# EasyEDA Pro project Omnimo_nRF52840.eprj, board Omnimo_nRF52840_v1_1
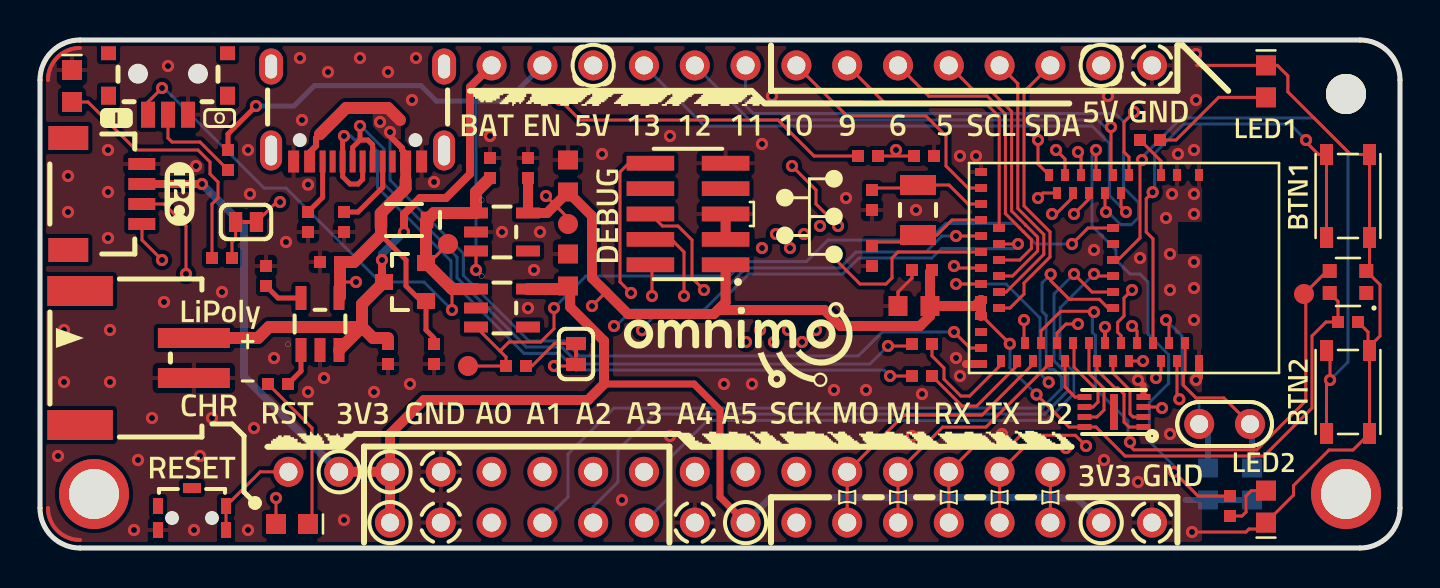
[diagram p2: board, top side]
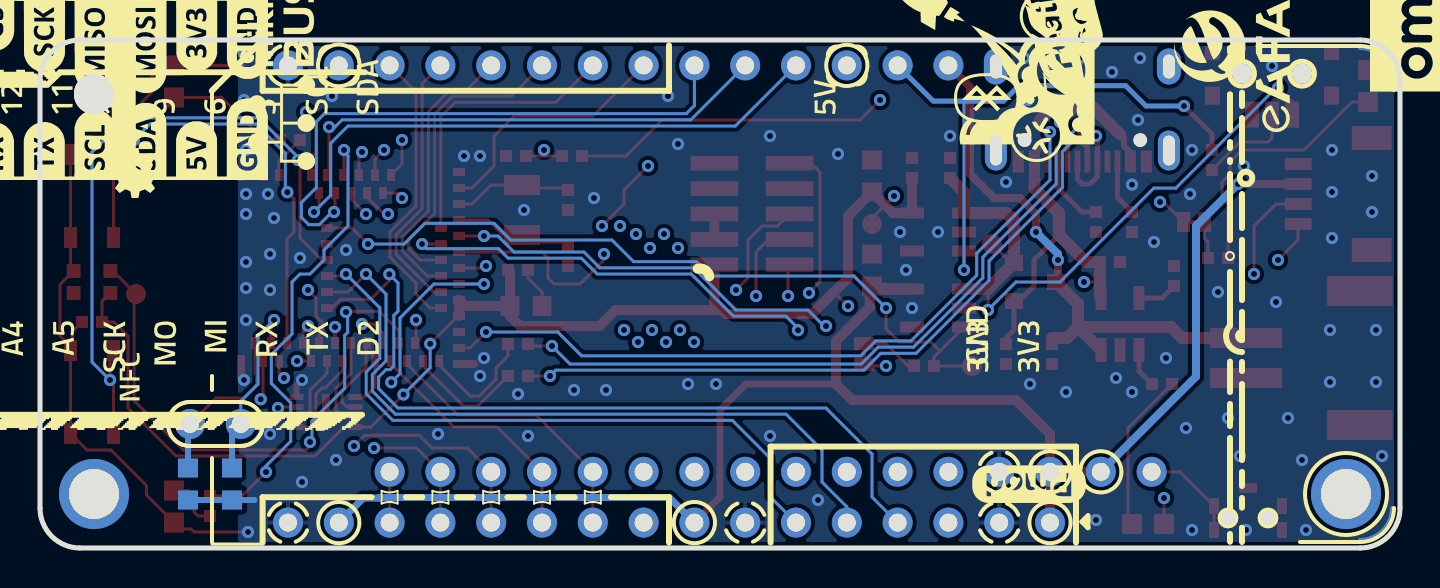
[diagram p3: board, bottom side, seen from below]

Outline 68 x 25.4 mm; copper layers: Top Layer, Mid-Top, Mid-Bottom, Bottom Layer. Coordinates in mm from the lower left corner of the outline.
Outline path: 0,23.4 arc(0.59,24.81) 2,25.4 66,25.4 arc(67.41,24.81) 68,23.4 68,2 arc(67.41,0.59) 66,0 2,0 arc(0.59,0.59) 0,2 0,23.4
Stack: Top Layer 0.035mm / Dielectric 1 0.27mm FR-4 er 4.5 / Mid-Top 0.017mm / Dielectric2 0.93mm FR-4 er 4.5 / Mid-Bottom 0.017mm / Dielectric3 0.27mm FR-4 er 4.5 / Bottom Layer 0.035mm

## Design rules (mm)
template: User Custom Config
spacing Clearance (default): track to track 0.15, other pairs 0.127 to 0.254
track width Width_1: min 0.15, default 0.31, max 1.001
track width Width (default): min 0.15, default 0.15, max 1
differential pair DiffPairsRouting (default): width min 0.381, default 0.381, max 0.381; gap min 0.254, default 0.254
via RoutingVias (default): diameter min 0.45, default 0.61, max 1.27; hole min 0.201, default 0.305, max 0.635

## Placement (name value [footprint] x y rotation side)
C1  10uF  [0603_Nom]  26.4 18.6 90 top
C2  1uF  [0402_NOM]  24.4 19 90 top
C3  1uF  [0402_NOM]  22.5 19 90 top
C4  100nF  [0402_NOM]  65.4 11.3 0 top
C5  4.7uF  [0402_NOM]  14.5 14.3 180 top
C6  4.7uF  [0402_NOM]  17.4 9.7 270 top
C7  12pF  [0402_NOM]  41.6 17.4 90 top
C8  12pF  [0402_NOM]  41.6 14.6 90 top
C9  10uF  [0603_Nom]  43.7 12.1 180 top
C11  100nF  [0402_NOM]  44.1 13.9 180 top
C21  DNP  [0603_Nom]  58.4 3.2 90 bottom
C22  DNP  [0603_Nom]  60.6 3.2 270 bottom
C24  10uF  [0603_Nom]  26.4 13.9 90 top
D1  RED  [LED-0603_2]  1.6 23.1 90 top
D2  ORANGE  [LED-0603_2]  12.6 1.2 0 top
D3  BLUE  [LED-0603_2]  61.3 2.07 270 top
D4  RED  [LED-0603_2]  61.3 23.33 90 top
D5  WS2812C-2020-V1  [WS2812-2020]  65.4 13.3 0 top
D6  BAT60B  [SOD-323]  18.2 16.4 180 top
J1  S2B-PH-SM4-TB(LF)(SN)  [conn-smd_p2.00_s2b-ph-sm4-tb-lf-sn]  4.87 9.5 270 top
J2L  omnimo_Header_left  [Omnimo_HDR_Left_nRF52_2 - without silk screen]  55.6 1.27 90 top
J2R  omnimo_Header_right  [Omnimo_HDR_Right_nRF52_2 - without silk screen]  55.6 24.13 90 top
J3  SM04B-SRSS-TB(LF)(SN)  [1x04_1mm_ra]  2.93 17.7 270 top
J4  FTSH-105-01-L-DV-K-TR  [SAMTEC_FTSH-105-XX-X-DV]  32.4 16.7 90 top
J5  TYPE-C 16PIN 2MD(073)  [usb-c-smd_type-c-6pin-2md-073]  15.88 21.7 180 top
J6  CONN_021X02  [1X02_NFC]  60.5 6.2 180 top
JP1  JUMPER-SMT_2_NC_TRACE_SILK  [SMT-JUMPER_2_NC_TRACE_SILK_2]  10.3 16.3 180 top
JP2  JUMPER-SMT_2_NC_TRACE_SILK  [SMT-JUMPER_2_NC_TRACE_SILK_2]  26.8 9.7 270 top
NOREF  -  [Pad_ie133]  65.3 2.7 0 top
NOREF#2  -  [Pad_ie134]  2.7 2.7 0 top
NOREF#3  -  [Pad_ie132]  65.3 22.7 0 top
Q3  DMG2305UXQ-7  [sot23-3]  18.3 13.3 0 top
R2  100kΩ  [0402_NOM]  19.7 9.7 90 top
R3  2.2kΩ  [0402_NOM]  55.5 20.4 0 top
R4  100kΩ  [0402_NOM]  9.4 19.4 90 top
R5  2kΩ  [0402_NOM]  11.3 13.6 270 top
R6  5.1kΩ  [0402_NOM]  11.9 8.2 180 top
R11  10kΩ  [0402_NOM]  9.1 14.5 180 top
R13  2.2kΩ  [0402_NOM]  59.5 2.1 270 top
R14  100kΩ  [0402_NOM]  41.4 19.6 180 top
R15  100kΩ  [0402_NOM]  44.2 19.6 180 top
R21  27Ω  [0402_NOM]  44.1 10.2 0 top
R22  27Ω  [0402_NOM]  44.1 8.6 0 top
R24  100kΩ  [0402_NOM]  23.8 9.1 0 top
R25  5.1kΩ  [0402_NOM]  13.4 16.3 90 top
R26  5.1kΩ  [0402_NOM]  15.2 16.3 90 top
S1  TA-3514-A1-B  [sw-smd_ta-3514-a1-b]  6.4 23.24 180 top
S2  R-667270  [sw-smd_mitsumi_r-667270]  7.6 1.95 0 top
S3  PTS815SJG250SMTRLFS  [SW_PTS810_SJM_250_SMTR_LFS]  65.4 17.6 90 top
S4  PTS815SJG250SMTRLFS  [SW_PTS810_SJM_250_SMTR_LFS]  65.4 7.8 90 top
TP1  TEST-POINT3X5  [TEST_POINT_1mm]  20.4 15.2 90 top
TP2  TEST-POINT3X5  [TEST_POINT_1mm]  26.4 16.2 90 top
TP3  TEST-POINT3X5  [TEST_POINT_1mm]  21.4 9.1 90 top
TP4  TEST-POINT3X5  [TEST_POINT_1mm]  63.2 12.7 90 top
U1  MDBT50Q  [MDBT50Q-1MV2]  54.2 14 270 top
U2  MCP73831T-2ACI/OT  [SOT23-5]  14 11.2 0 top
U3  AP2112K-3.3TRG1  [SOT23-5]  23.1 15.8 270 top
U4  GD25Q16EEIGR  [USON-8_L3.0-W2.0-P0.50-BL-EP_GD25QXX]  53.7 6.8 90 top
U5  AP2112K-3.3TRG1  [SOT23-5]  23.1 12 270 top
Y2  32.768kHz  [CRYSTAL-SMD-3.2X1.5MM]  43.9 16.9 270 top

## Footprints (pads in the part's own frame, mm; a bottom-side part is the same pattern mirrored in y, then rotated)
1X02_NFC
  round 1.5 hole 0.9: 1(0,0) 2(2.54,0)
1x04_1mm_ra
  rect 0.6x1.35 smd: 1(-1.5,2.159) 2(-0.5,2.159) 3(0.5,2.159) 4(1.5,2.159)
  rect 1.2x2 smd: NC1(2.8,-1.516) NC2(-2.8,-1.516)
0402_NOM
  rect 0.6x0.6 smd: 1(-0.5,0) 2(0.5,0)
0603_Nom
  rect 0.95x1 smd: 1(-0.8,0) 2(0.8,0)
conn-smd_p2.00_s2b-ph-sm4-tb-lf-sn
  rect 1x3.6 smd: 1(-1,2.825) 2(1,2.825)
  rect 1.5x3.28 smd: 3(3.35,-2.865) 4(-3.35,-2.865)
CRYSTAL-SMD-3.2X1.5MM
  rect 1x1.8 smd: P$1(-1.25,0) P$2(1.25,0)
LED-0603_2
  rect 1x1 smd: A(-0.8,0) C(0.8,0)
MDBT50Q-1MV2
  rect 0.6x0.4 smd: 1(-4.65,3.75) 2(-4.65,2.65) 3(-4.65,1.85) 4(-4.65,0.25) 5(-3.75,-0.15) 6(-4.65,-0.55) 7(-3.75,-0.95) 8(-4.65,-1.35) 9(-3.75,-1.75) 10(-4.65,-2.15) 11(-3.75,-2.55) 12(-4.65,-2.95) 13(-3.75,-3.35) 14(-4.65,-3.75) 34(4.65,-6.15) 35(4.65,-5.35) 36(3.75,-4.95) 37(4.65,-4.55) 38(3.75,-4.15) 39(4.65,-3.75) 40(3.75,-3.35) 41(4.65,-2.95) 42(3.75,-2.55) 43(3.75,-1.75) 44(4.65,-1.35) 45(3.75,-0.95) 46(4.65,-0.55) 47(3.75,-0.15) 48(4.65,0.25) 49(3.75,0.65) 50(3.75,1.45) 51(4.65,1.85) 52(3.75,2.25) 53(4.65,2.65) 54(3.75,3.05) 55(4.65,3.75)
  rect 0.4x0.6 smd: 15(-4.8,-7.15) 16(-4,-7.15) 17(-3.2,-7.15) 18(-2.4,-7.15) 19(-2,-6.25) 20(-1.6,-7.15) 21(-1.2,-6.25) 22(-0.8,-7.15) 23(-0.4,-6.25) 24(0,-7.15) 25(0.4,-6.25) 26(0.8,-7.15) 27(1.2,-6.25) 28(1.6,-7.15) 29(2,-6.25) 30(2.4,-7.15) 31(3.2,-7.15) 32(4,-7.15) 33(4.8,-7.15) 56(-2,-0.55) 57(-1.2,-0.55) 58(-0.4,-0.55) 59(0.4,-0.55) 60(1.2,-0.55) 61(2,-0.55)
Omnimo_HDR_Left_nRF52_2 - without silk screen
  round 1.5 hole 0.9: 15(0,0) 16(0,2.54) 17(2.54,5.08) 18(0,5.08) 19(2.54,7.62) 20(0,7.62) 21(2.54,10.16) 22(0,10.16) 23(2.54,12.7) 24(0,12.7) 25(2.54,15.24) 26(0,15.24) 27(2.54,17.78) 28(0,17.78) 29(2.54,20.32) 30(0,20.32) 31(2.54,22.86) 32(0,22.86) 33(2.54,25.4) 34(0,25.4) 35(2.54,27.94) 36(0,27.94) 37(2.54,30.48) 38(0,30.48) 39(2.54,33.02) 40(0,33.02) 41(2.54,35.56) 42(0,35.56) 43(2.54,38.1) 44(0,38.1) 45(2.54,40.64) 46(2.54,43.18)
Omnimo_HDR_Right_nRF52_2 - without silk screen
  round 1.5 hole 0.9: 1(0,0) 2(0,2.54) 3(0,5.08) 4(0,7.62) 5(0,10.16) 6(0,12.7) 7(0,15.24) 8(0,17.78) 9(0,20.32) 10(0,22.86) 11(0,25.4) 12(0,27.94) 13(0,30.48) 14(0,33.02)
Pad_ie132
  round 2 hole 2.5: 0(0,0)
Pad_ie133
  round 3.5 hole 2.5: 0(0,0)
Pad_ie134
  round 3.5 hole 2.5: 0(0,0)
SAMTEC_FTSH-105-XX-X-DV
  rect 0.74x2.38 smd: 1(-2.54,-1.88) 2(-2.54,1.88) 3(-1.27,-1.88) 4(-1.27,1.88) 5(0,-1.88) 6(0,1.88) 7(1.27,-1.88) 8(1.27,1.88) 9(2.54,-1.88) 10(2.54,1.88)
SMT-JUMPER_2_NC_TRACE_SILK_2
  rect 0.66x1 smd: 1(0.52,0) 2(-0.52,0)
SOD-323
  rect 0.63x0.83 smd: A(1.15,0) C(-1.15,0)
sot23-3
  rect 0.9x0.8 smd: 1(1,-0.95) 2(1,0.95) 3(-1.1,0)
SOT23-5
  rect 0.55x1.2 smd: 1(-0.95,-1.3) 2(0,-1.3) 3(0.95,-1.3) 4(0.95,1.3) 5(-0.95,1.3)
sw-smd_mitsumi_r-667270
  rect 0.5x0.8 smd: 1(-1.7,-1.05) 2(1.7,-1.05) 3(1.7,0.15) 5(-1.7,0.15)
  rect 0.9x0.5 smd: 4(0,1.05)
sw-smd_ta-3514-a1-b
  rect 0.7x1.3 smd: 1(-1,1.575) 2(0,1.575) 3(1,1.575)
  rect 0.75x0.9 smd: 4(2.975,0.625) 7(-2.975,0.625)
  rect 0.75x0.7 smd: 5(2.975,-1.5) 6(-2.975,-1.5)
SW_PTS810_SJM_250_SMTR_LFS
  rect 1.05x0.65 smd: 1(-2.075,1.075) 2(2.075,1.075) 3(-2.075,-1.075) 4(2.075,-1.075)
TEST_POINT_1mm
  rrect 1x1 smd: P$1(0,0)
usb-c-smd_type-c-6pin-2md-073
  rect 0.55x1.1 smd: 1(-3.2,2.375) 2(-2.4,2.375) 11(2.4,2.375) 12(3.2,2.375)
  rect 0.3x1.1 smd: 3(-1.75,2.375) 4(-1.25,2.375) 5(-0.75,2.375) 6(-0.25,2.375) 7(0.25,2.375) 8(0.75,2.375) 9(1.25,2.375) 10(1.75,2.375)
  oval 1.1x2 hole 0.6x1.5: 13(-4.325,1.825) 14(4.325,1.825)
  oval 1.2x1.8 hole 0.6x1.2: 13(-4.325,-2.375) 14(4.325,-2.375)
USON-8_L3.0-W2.0-P0.50-BL-EP_GD25QXX
  rect 0.3x0.7 smd: 1(-0.75,-1.473) 2(-0.249,-1.473) 3(0.251,-1.473) 4(0.75,-1.473) 5(0.75,1.473) 6(0.251,1.473) 7(-0.249,1.473) 8(-0.75,1.473)
  rect 1.8x0.4 smd: 9(0,0)
WS2812-2020
  rect 0.7x0.7 smd: DI(-0.915,0.55) DO(0.915,-0.55) GND(0.915,0.55) VCC(-0.915,-0.55)

## Nets
As in the schematic.

Pads without a net: D5 DO; J1 3 4; J3 NC1 NC2; J4 7 8; J5 3 9 13 14; NOREF 0; NOREF#2 0; NOREF#3 0; S1 4 5 6 7; S2 4 5; U1 31 57; U3 4; U4 9; U5 4

## Via types
v1: diameter 0.61, hole 0.301, Top Layer to Bottom Layer, 53 vias
v2: diameter 0.61, hole 0.305, Top Layer to Bottom Layer, 116 vias
v3: diameter 0.6, hole 0.305, Top Layer to Bottom Layer, 1 via
v4: diameter 0.6, hole 0.3, Top Layer to Bottom Layer, 2 vias

## Routing (per net, layer and track width the routed paths; a pad name or vN(x,y) marks a point on that pad's centre or on a via; arc(x,y) is an arc through that point)
3.3V: length 86.4
  Top Layer w0.15: 10.83,16.3 11.83,17.3 v2(12,17.3) 12,17.48 ; v2(49.83,7.67) 51.45,6.05 U4.8 52.8,6.05 54.25,4.6 61.2,4.6 63.6,7 63.6,10.6 64.3,11.3 C4.1 64.9,12.33 D5.VCC ; TP2.P$1 26.4,16.5 v2(25.3,17.6) ; U1.30 47.15,11.5 47.2,11.5 v2(48.49,10.21) ; v2(25.7,9.1) 26.72,9.1 JP2.1 ; v2(27.6,12.1) 28.3,12.8
  Top Layer w0.5: J4.1 34.28,12.28 33.9,11.9 ; C9.1 46.75,12.1 U1.28 U1.30 ; C9.1 44.5,11.6 44,11.1 40.02,11.1 39.22,11.9 33.9,11.9 ; C9.1 44.5,13.8 C11.1 ; C2.1 U3.5 25.35,16.75 C1.1 27.6,16.6 27.6,13.5 29.4,11.7 33.7,11.7 33.9,11.9
  Mid-Bottom w0.15: v2(25.7,9.1) 27.6,11 v2(27.6,12.1) ; v2(25.3,17.6) 25,17.3 v2(12,17.3)
  Bottom Layer w0.15: v2(49.83,7.67) 48.49,9.01 v2(48.49,10.21)
GND: length 67.8
  Top Layer w0.15: 57.83,24.13 D4.C 61.87,24.13 62.4,23.61 62.4,22.81 65.53,19.67 S3.4 S3.3 66.47,14.01 D5.GND 67,13.17 67,10.6 66.47,10.08 S4.4 ; C9.2 42.9,12.8 43.6,13.5 C11.2 ; C4.2 66.4,10.8 66.4,9.95 S4.4 ; 65.65,4.9 S4.3 S4.4 ; v1(57.6,0.8) 60.3,0.8 60.45,0.95 60.98,0.95 D3.C 62.68,2.65 62.68,3.12 64.45,4.9 65.6,4.9
  Top Layer w0.2: 2,25 arc(0.87,24.53) 0.4,23.4 ; 0.4,2 arc(0.87,0.87) 2,0.4
  Top Layer w0.3: U4.4 55.17,8.13 v3(54.9,8.4)
  Top Layer w0.4: U1.55 57.95,8.55 v1(57.8,8.4) ; 46.3,9.2 U1.33
  Top Layer w0.5: J4.3 J4.5
  Mid-Top w0.2: 0.4,2 arc(0.87,0.87) 2,0.4 ; 2,25 arc(0.87,24.53) 0.4,23.4
  Mid-Bottom w0.2: 2,25 arc(0.87,24.53) 0.4,23.4 ; 0.4,2 arc(0.87,0.87) 2,0.4
  Bottom Layer w0.2: 2,25 arc(0.87,24.53) 0.4,23.4 ; 0.4,2 arc(0.87,0.87) 2,0.4
  Bottom Layer w0.3: C22.2 C21.1 57.28,2.4
  vias: v1(0.9,4.6) v1(1.2,10.9) v1(1.2,8.3) v1(1.4,18.6) v1(1.4,16.8) v1(3.4,19.9) v1(3.4,17.8) v1(3.4,15.5) v1(3.5,10.9) v1(3.5,8.3) v1(4.7,0.9) v1(4.9,4.4) v1(5.6,6.5) v1(8.6,6.5) v1(10.4,19.9) v1(10.5,17.7) v1(12.3,15.3) v1(13,24.5) v1(13.1,21.4) v1(13.4,18.17) v1(14.4,23.8) v1(15.2,1.4) v1(16,24.5) v1(17.4,23.8) v1(18.6,22.4) v1(18.8,24.5) v1(19.7,18.3) v1(22.5,20.6) v1(24.7,13.9) v1(29.1,2.4) v1(34.2,8.2) v1(43.6,5.6) v1(44.1,7.7) v1(46,19.6) v1(46.8,19.6) v1(48.1,5.7) v1(53.2,4.4) v1(55,14.5) v1(56.3,16.5) v1(56.5,14.7) v1(56.6,17.7) v1(56.9,19.7) v1(57.7,19.9) v1(57.7,17.7) v1(57.7,16.7) v1(57.7,14.3) v1(57.7,13) v1(57.7,11.4) v1(57.8,24.7) v1(57.8,22.4) v2(6.2,12.3) v2(6.4,24.1) v2(7.7,0.9) v2(7.8,19.1) v2(8,4.6) v2(9.1,12.8) v2(10.4,0.9) v2(10.7,6) v2(11.7,9.5) v2(13.4,7.8) v2(14.2,8.5) v2(16.7,7.8) v2(18.5,8.2) v2(23.1,15.8) v2(24.4,12) v2(25,15.8) v2(28.1,19.7) v2(31.5,20.6) v2(31.5,5.6) v2(35.6,8.2) v2(36.1,20.2) v2(36.6,22.6) v2(39.7,7.9) v2(40.3,17.5) v2(41.3,7.9) v2(43.8,16.9) v2(45.8,9.5) v2(46,8.6) v2(52.7,14.9) v2(53.4,22.6) v2(54.9,3.3) v2(56.5,12.9) v2(56.5,5.7)
VBAT: length 49.1
  Top Layer w0.15: R14.2 38.7,19.6 36.9,21.4 27,21.4 v2(26,22.4)
  Top Layer w0.4: v2(17.1,14.4) 17.1,13.4 Q3.3 ; J2R.14 21.5,23.05 21.5,18.7 20.3,17.5 19,17.5 18.2,16.7 v2(18.2,15.8)
  Top Layer w0.6: Q3.3 16.1,12.2 16.1,11.05 ; 17.4,10.5 16.65,10.5 16.1,11.05 ; 7.2,10.5 10.9,10.5 11.45,11.05 16.1,11.05 ; 16.1,11.05 U2.3
  Mid-Bottom w0.15: v2(26,22.4) 24.31,22.4 J2R.14
  Bottom Layer w0.4: v2(17.1,14.4) 17.1,14.7 v2(18.2,15.8)
VBUS: length 114.9
  Top Layer w0.15: 15,13.3 v2(15.8,13.3) ; v2(45.7,10.8) 46.5,10 U1.32 ; D2.A v2(11.8,2.5)
  Top Layer w0.25: 17.05,15.65 18.3,14.4 18.3,13.1 19.05,12.35 Q3.1 19.3,10.9 19.7,10.5
  Top Layer w0.3: v2(17.5,20.8) 17.5,20.6 18.1,20 18.1,19.9 18.28,19.72 J5.2 ; 14,20.69 13.81,20.5 13.8,20.5 13.8,20.1 13.48,19.78 J5.11
  Top Layer w0.54: J5.2 18.28,18.4
  Top Layer w0.6: 18.28,18.4 18.28,17.98 17.05,16.75 D6.A 17.05,15.65 15.7,14.3 C5.1 15,12.55 ; 18,21.4 17.4,22 15.31,22 14,20.69
  Mid-Bottom w0.15: v2(11.8,2.5) 11.2,3.1 11.2,4.3 15.8,8.9 v2(15.8,13.3)
  Mid-Bottom w0.5: v2(17.5,20.8) 18.2,21.5 37.71,21.5 38.51,22.3 51.23,22.3 J2R.2 ; 27.66,21.54 J2R.12
  Bottom Layer w0.15: v2(45.7,10.8) 42.11,10.8 40.92,9.61 26.96,9.61 26.22,10.35 24.45,10.35 21.17,13.64 21.17,14.73 17.5,18.4 v2(17.5,20.8) ; 17,21.19 v2(17,21.3)
VIN: length 33
  Top Layer w0.15: v2(20.6,11.9) 20.6,12.95 ; v2(6.1,23) 5.4,22.3 S1.3 ; 19.45,14.25 TP1.P$1
  Top Layer w0.6: C3.1 21.8,17.8 U3.1 19.7,16.75 D6.C 19.3,16.35 Q3.2 20.6,12.95 U5.1
  Bottom Layer w0.15: v2(6.1,23) 6.2,23 11.2,18 12.31,18 17,13.3 19.2,13.3 v2(20.6,11.9)
A0: length 30
  Top Layer w0.15: v2(45.8,15.6) U1.20
  Mid-Bottom w0.15: J2L.39 22.58,4.98 v2(28.7,11.1)
  Bottom Layer w0.15: v2(28.7,11.1) 28.8,11.1 29.6,11.9 33.2,11.9 35.31,14.01 40.01,14.01 40.8,14.8 44.3,14.8 45.1,15.6 v2(45.8,15.6)
A1: length 30.7
  Top Layer w0.15: U1.21 v4(48.9,15.2)
  Mid-Bottom w0.15: J2L.37 25.12,5.91 v2(30.1,10.89)
  Bottom Layer w0.15: v4(48.9,15.2) 48.67,14.97 45.07,14.97 44.59,14.49 40.93,14.49 40.14,13.7 35.44,13.7 33.33,11.59 30.7,11.59 30.1,10.99 v2(30.1,10.89)
A2: length 37.9
  Top Layer w0.15: U1.14 49.9,19.2 v2(49.9,20.4)
  Mid-Top w0.15: v2(36.8,15.7) 36.8,14.4 36,13.6 v2(36,10.9)
  Mid-Bottom w0.15: v2(49.9,20.4) 49.32,19.82 48.39,19.82 47.36,20.85 38.19,20.85 36.8,19.46 v2(36.8,15.7) ; J2L.35 27.66,5.36 31.8,9.5 35.4,9.5 36,10.1 v2(36,10.9)
A3: length 33.1
  Top Layer w0.15: v2(49.9,17.5) 50.15,17.75 U1.13
  Mid-Top w0.15: v2(37.5,15) 37.5,14.5 36.7,13.7 v2(36.7,10.3)
  Mid-Bottom w0.15: v2(36.7,10.3) 35.59,9.19 32.99,9.19 30.2,6.4 J2L.33 ; v2(49.9,17.5) 48.51,18.89 38.39,18.89 37.5,18 v2(37.5,15)
A4: length 31.3
  Top Layer w0.15: U1.11 51.65,17.55 50.8,16.7 v2(50.6,16.7)
  Mid-Top w0.15: v2(38.2,15.7) 38.2,12.2 37.4,11.4 v2(37.4,10.9)
  Mid-Bottom w0.15: v2(38.2,15.7) 38.2,17.7 39.08,18.58 47.92,18.58 49.8,16.7 v2(50.6,16.7) ; 32.74,3.84 37.4,8.5 v2(37.4,10.9)
A5: length 29.1
  Top Layer w0.15: v2(51.7,16.7) 52.45,17.45 U1.9
  Mid-Top w0.15: v2(39,16.1) 39,15.6 38.51,15.11 38.51,12.01 38.1,11.6 v2(38.1,10.3)
  Mid-Bottom w0.15: v2(38.1,10.3) 38.1,6.63 J2L.29 ; v2(39,16.1) 39.77,15.33 40.06,15.33 40.5,14.9 46,14.9 47.1,16 51,16 v2(51.7,16.7)
AN: length 36.5
  Top Layer w0.15: v2(39.9,16.1) 38.8,17.2 38.8,17.9 v2(37.6,19.1) ; U1.12 51.25,19.45 v2(50.8,19.9)
  Mid-Top w0.15: v2(38.8,10.9) 38.82,10.92 38.82,14.98 39.9,16.06 v2(39.9,16.1)
  Mid-Bottom w0.15: v2(37.6,19.1) 39.04,20.54 47.23,20.54 48.26,19.51 50.41,19.51 v2(50.8,19.9) ; J2L.28 36.55,2.54 36.55,4.65 38.41,6.5 38.41,9.2 38.8,9.59 v2(38.8,10.9)
D2: length 16.6
  Top Layer w0.15: J2L.18 J2L.17 ; v4(45.8,13.2) U1.26
  Mid-Bottom w0.15: J2L.17 50.44,3.89 50.44,7.37 50.46,7.39 50.46,8.26 v2(50.44,8.29)
  Bottom Layer w0.15: v2(50.44,8.29) 50,8.72 50,11.5 48.3,13.2 v4(45.8,13.2)
D5: length 14.1
  Top Layer w0.15: U1.25 48.63,13.6 49.88,14.85 49.88,15.55 49.29,16.14 49.28,16.14 49.28,16.14 49.28,16.15 48.58,16.85 48.58,21.82 47.5,22.9 46.67,22.9 J2R.5
D6: length 15.5
  Top Layer w0.15: U1.23 48.99,14.4 49.57,14.98 49.57,15.42 49.16,15.83 49.16,15.83 48.97,16.02 48.97,16.02 48.27,16.72 48.27,21.69 47.37,22.59 44.44,22.59 J2R.6
D9: length 14.2
  Top Layer w0.15: 47.96,16 47.96,21.56 47.24,22.28 42.21,22.28 J2R.7
D10: length 12.6
  Top Layer w0.15: J2R.8 40.35,21.6 44.3,21.6 45.3,20.6 45.3,19.1 46.4,18 U1.16
D11: length 29.3
  Top Layer w0.15: U1.7 53.25,16.85 v2(53.3,16.8)
  Bottom Layer w0.15: v2(53.3,16.8) 53.4,16.8 54.04,16.17 54.56,16.17 54.93,16.54 54.93,17.27 54.2,18 ; J2R.9 35.28,22.12 35.68,21.72 53.77,21.72 54.18,21.31 54.18,18.02
D12: length 24.6
  Top Layer w0.15: U1.6 53.55,18.75 v2(53.55,21.05)
  Bottom Layer w0.15: v2(53.55,21.05) 53.4,20.9 52.89,21.41 35.46,21.41 J2R.10
D13: length 29.7
  Top Layer w0.15: U1.5 54.05,17.05 v2(54.3,16.8)
  Bottom Layer w0.15: v2(54.3,16.8) 53.47,17.63 53.47,20.23 52.6,21.1 33.23,21.1 J2R.11
EN: length 28
  Top Layer w0.15: v2(21.8,13.9) U3.3
  Top Layer w0.25: v1(10.8,22.1) 9.4,20.7 R4.2
  Bottom Layer w0.15: v2(21.8,13.9) 21.8,22.34
  Bottom Layer w0.25: v1(10.8,22.1) 12.7,22.1 13.72,23.12 19.05,23.12 19.82,22.34 23.34,22.34 J2R.13
LED1: length 2.2
  Top Layer w0.15: U1.3 56.05,19.35 R3.1
LED2: length 23.6
  Top Layer w0.15: U1.8 52.8,18.7 v2(52.8,19.9) ; R13.1 57.9,2.6 v2(56.7,3.8)
  Bottom Layer w0.15: v2(52.8,19.9) 52.8,19.8 52.6,19.6 52.6,16.1 53.8,14.9 53.8,14.4 54.5,13.7 55,13.7 55.4,13.3 55.4,10.7 56.43,9.67 56.43,8.23 55.47,7.27 55.47,5.33 56.73,4.07 56.73,3.83 v2(56.7,3.8)
MISO: length 12.5
  Top Layer w0.15: 50.45,9.2 47.3,6.05 45.14,6.05 J2L.23 J2L.24
  Top Layer w0.2: 50.45,9.2 U1.39
MOSI: length 14.2
  Top Layer w0.15: 49.65,9.2 47.1,6.65 43.2,6.65 J2L.25 J2L.26
  Top Layer w0.2: 49.65,9.2 U1.37
NEOPIX: length 28.2
  Top Layer w0.15: U1.38 50.05,10.85 51.03,11.83 52.67,11.83 v2(52.7,11.8) ; D5.DI 64.35,13.85 TP4.P$1 63.29,12.61 63.29,7.36 60.84,4.91 54.69,4.91 54.5,5.1 v2(54.5,5.3)
  Bottom Layer w0.15: v2(54.5,5.3) 54.4,5.4 54.4,6.35 52.77,7.98 52.77,10.63 52.62,10.78 52.62,11.72 v2(52.7,11.8)
NFC1: length 9.5
  Top Layer w0.15: U1.52 56.45,11.25 v2(56.3,11.4)
  Bottom Layer w0.15: v2(56.3,11.4) 57.1,10.6 57.1,8.2 57.96,7.34 J6.2 58.4,5.76
  Bottom Layer w0.3: C21.2 58.4,5.76
NFC2: length 8.5
  Top Layer w0.15: U1.54 57.25,10.25 57.25,8.75 57.17,8.66 57.17,8.14 57.8,7.5 59.2,7.5 J6.1
  Bottom Layer w0.15: J6.1 60.6,6.1
  Bottom Layer w0.3: C22.1 60.6,6.1
PM5: length 50.1
  Top Layer w0.15: U1.4 54.45,19.55 54.2,19.8 54.2,21.3 v2(54.7,21.8)
  Mid-Top w0.15: v2(35.3,10.3) 35.3,13.44 36.1,14.24 v2(36.1,15)
  Mid-Bottom w0.15: J2L.40 23.81,2.5 25.44,2.5 26.4,3.46 26.4,5.6 31.1,10.3 v2(35.3,10.3) ; v2(54.7,21.8) 38.7,21.8 36.1,19.2 v2(36.1,15)
PM6: length 40.4
  Top Layer w0.15: v2(50.53,13.69) 50.53,13.37 51.47,12.43 52.97,12.43 53.4,12 U1.61
  Bottom Layer w0.15: J2L.38 26.4,2.55 26.4,4.7 28.7,7 50.1,7 51.07,7.97 51.07,8.55 50.7,8.92 50.49,8.92 50.31,9.1 50.31,11.63 50.1,11.84 50.1,13.25 v2(50.53,13.69) 50.51,13.69
PM7: length 36.7
  Top Layer w0.15: U1.60 52.6,12.8 v2(51.7,13.7)
  Bottom Layer w0.15: v2(51.7,13.7) 50.7,12.7 50.7,9.36 51.38,8.68 51.38,7.84 50.23,6.69 30.69,6.69 28.9,4.9 28.9,3.3 27.66,2.06 J2L.36
PM8: length 33.4
  Top Layer w0.15: U1.59 52.8,13.6 v2(52.7,13.7)
  Bottom Layer w0.15: J2L.34 31.5,2.57 31.5,4.5 33.38,6.38 50.36,6.38 51.69,7.71 51.69,8.81 51.01,9.49 51.01,12.01 v2(52.7,13.7) 52.6,13.7
QSPI_CS: length 4.8
  Top Layer w0.15: U4.1 54.45,6.05 54.2,6.3 54.2,7.7 53.9,8 53.75,8 52.85,8.9 U1.44
QSPI_DATA0: length 2.5
  Top Layer w0.15: U1.41 51.25,8.05 51.75,7.55 U4.5
QSPI_DATA1: length 3.7
  Top Layer w0.15: U4.2 54.65,6.55 54.5,6.7 54.5,7.89 53.65,8.74 U1.46
QSPI_DATA2: length 7.9
  Top Layer w0.15: v2(56.1,7) 56.05,7.05 U4.3
  Top Layer w0.2: U1.45 v2(53.25,11.05)
  Mid-Top w0.15: v2(53.25,11.05) 53.25,8.35 54.6,7 v2(56.1,7)
QSPI_DATA3: length 4.8
  Top Layer w0.15: U1.43 52.45,10.25 52.45,8.73 53.2,7.98 53.2,6.9 52.85,6.55 U4.7
QSPI_SCK: length 4.2
  Top Layer w0.15: U1.42 51.7,10.2 51.7,9.04 52.9,7.84 52.9,7.3 52.65,7.05 U4.6
QWIIC_SCL: length 46.4
  Top Layer w0.15: v2(6.1,14.4) 5.1,15.4 5.1,16.2 ; v2(39.8,14.7) 39.8,14.4 41,13.2 42.3,13.2 42.6,13.5 42.6,14.5 42.9,14.8 U1.22
  Mid-Bottom w0.15: v2(39.8,14.7) 38.1,14.7 37.76,14.37 35.84,14.37 35.19,15.01 20.67,15.01 19.43,13.77 16.73,13.77 16.17,14.33 6.17,14.33 v2(6.1,14.4)
QWIIC_SDA: length 46
  Top Layer w0.15: 5.1,17.2 6.2,17.2 7.3,16.1 v2(7.3,13.7) ; U1.24 45.8,14 v2(45.7,14.1)
  Mid-Bottom w0.15: v2(45.7,14.1) 40.1,14.1 40.06,14.07 37.9,14.07 37.89,14.06 35.71,14.06 35.06,14.7 20.8,14.7 19.56,13.46 16.61,13.46 16.04,14.02 7.62,14.02 v2(7.3,13.7)
RESET: length 59.5
  Top Layer w0.15: J2L.46 11.01,3.81 S2.3 S2.2 ; v2(51.9,11.2) 51.3,11.2 50.85,10.75 U1.40 ; J4.10 29.44,19.24 29,18.8 29,13.3 v2(29.55,12.75)
  Mid-Bottom w0.15: 46.2,11.59 30.71,11.59 30.71,11.59 v2(29.55,12.75) 20.35,12.75 12.42,4.82 J2L.46 ; v2(51.9,11.2) 51.07,12.03 47.48,12.03 47.09,11.64 46.25,11.64
RXD: length 16.7
  Top Layer w0.15: U1.48 v2(55.15,9.35) ; v2(52.3,5.1) 51.77,5.63 49.03,5.63 48.4,5 46.63,5 J2L.21 J2L.22
  Mid-Bottom w0.15: v2(55.15,9.35) 54.9,9.35 52.3,6.75 v2(52.3,5.1)
SCK: length 16.7
  Top Layer w0.15: v2(49.2,11.4) 49.2,10.3 U1.36
  Mid-Bottom w0.15: J2L.27 40.61,6.6 45.2,6.6 47,8.4 47,10.2 48.2,11.4 v2(49.2,11.4)
SCL: length 13.4
  Top Layer w0.15: J2R.4 48.89,23.22 48.89,16.98 50.19,15.68 50.19,14.68 48.31,12.8 U1.27
SDA: length 14.6
  Top Layer w0.15: J2R.3 49.2,22.81 49.2,17.1 50.5,15.8 50.5,14.55 49.2,13.25 49.2,12.7 48.5,12 U1.29
SWCLK: length 35
  Top Layer w0.15: v2(56.96,7.44) 56.85,7.55 U1.53 ; v2(32.2,12.6) 32.2,14.8 31.57,15.43 J4.4
  Mid-Bottom w0.15: v2(32.2,12.6) 32.54,12.26 46.83,12.26 47.31,12.74 53.86,12.74 54.34,12.27 54.77,12.27 55.54,11.49 55.54,10.29 56.96,8.87 v2(56.96,7.44)
  Bottom Layer w0.15: v2(56.96,7.44) 57,7.4
SWDIO: length 31.1
  Top Layer w0.15: U1.51 56.05,8.75 v2(55.8,8.5) ; v2(30.6,12.6) 30.6,14.08
  Mid-Bottom w0.15: v2(55.8,8.5) 55.8,9.6 55.23,10.17 55.23,11.36 54.64,11.96 54.21,11.96 53.73,12.43 47.44,12.43 46.96,11.95 31.25,11.95 v2(30.6,12.6)
SWITCH1: length 23.7
  Top Layer w0.15: 64.32,15.53 64.32,19.67 63.93,19.67 63.3,20.3 ; U1.50 55.65,15.46 55.31,15.8 55.31,17.47 v2(55.63,17.79)
  Bottom Layer w0.15: v2(55.63,17.79) 55.73,17.89 55.73,19.73 57.2,21.2 62.5,21.2 v2(63.3,20.4)
SWITCH2: length 33.8
  Top Layer w0.15: U1.58 53.9,14.4 55,15.5 55,19.3 v2(55.1,19.4) ; 64.32,9.88 64.5,9.7 v2(64.5,8.4) 64.32,8.22 64.32,5.72
  Bottom Layer w0.15: v2(64.5,8.4) 65.4,9.3 65.4,19.8 63.69,21.51 57.07,21.51 55.1,19.54 v2(55.1,19.4)
SWO: length 30.2
  Top Layer w0.15: J4.6 31.12,16.1 31.9,16.1 32.6,15.4 32.6,13.5 v2(33.2,12.9) ; U1.47 54.05,10.62 53.88,10.79 53.88,11.28 54.2,11.6 54.2,12.5 v2(54.6,12.9)
  Mid-Bottom w0.15: v2(54.6,12.9) 54.45,13.05 47.18,13.05 46.7,12.57 33.53,12.57 v2(33.2,12.9)
TXD: length 14.8
  Top Layer w0.15: 54.85,10.25 U1.49 54.85,10.85 v2(54.6,11.1) ; v2(51.3,5) 49.17,5 J2L.19 J2L.20
  Mid-Bottom w0.15: v2(51.3,5) 51.3,6.3 54.52,9.52 54.52,11.02 v2(54.6,11.1)
USBD+: length 39.2
  Top Layer w0.15: v2(42.5,8.6) R22.1
  Top Layer w0.25: 16.13,19.33 16.13,18.43 15.9,18.2 15.5,18.2 15.13,18.57 15.13,20.53 v2(15.2,20.6)
  Bottom Layer w0.15: v2(15.2,20.6) 15.54,20.6 15.72,20.42 16.28,20.42 16.88,19.82 16.88,18.02 20.55,14.35 20.55,13.38 24.19,9.73 25.96,9.73 26.81,8.89 42.21,8.89 v2(42.5,8.6)
USBD-: length 38.1
  Top Layer w0.15: R21.1 43.5,10.1 v2(42.4,10.1)
  Top Layer w0.25: 16,20.4 v2(16,21.1) ; 16,20.4 16.4,20.4 16.63,20.17 16.63,19.33 ; 16,20.4 15.63,20.03 15.63,19.33
  Bottom Layer w0.15: v2(42.4,10.1) 41.5,9.2 26.94,9.2 26.09,10.04 24.32,10.04 20.86,13.51 20.86,14.54 17.19,18.21 17.19,19.96 16.05,21.1
  Bottom Layer w0.25: v2(16,21.1) 16.05,21.1
VDIV: length 12.8
  Top Layer w0.15: R14.1 R15.2 ; U1.10 52.05,19.65
  Mid-Bottom w0.15: 52,19.8 v2(51.9,19.8) 51.3,19.2 48.13,19.2 47.1,20.23 43.13,20.23 v2(42.8,19.9)
VOUT: length 77.7
  Top Layer w0.35: J2L.30 34,2.55 34,6.9 32.7,8.2 28.2,8.2
  Top Layer w0.4: v2(8.1,18.2) 5.3,18.2
  Top Layer w0.5: J2L.44 J2L.43 ; J2L.43 17.5,5.7 19.2,7.4 27.4,7.4 28.2,8.2 28.2,10.36 26.51,12.05 26.51,13.1 ; J2L.43 J2L.45 ; 26.25,12.95 C24.1
  Top Layer w0.6: U5.5 26.25,12.95
  Bottom Layer w0.35: J2L.30 36.53,2.53 51.04,2.53 51.06,2.5 51.83,2.5 J2L.16
  Bottom Layer w0.4: v2(8.1,18.2) 10.2,16.1 10.2,8.57 J2L.45
VOUT_EN: length 38.6
  Top Layer w0.15: U5.3 23,9.85 ; 23,9.85 23.3,9.55 R24.1 ; 23,9.85 23.45,10.3 25.03,10.3 25.7,10.97 v2(25.7,12) ; v2(51.6,15.2) 52.4,16 U1.56 ; 21.6,9.1 23,9.1
  Bottom Layer w0.15: v2(51.6,15.2) 49.79,15.2 48.76,16.23 45.3,16.23 44.46,15.4 39.4,15.4 38.32,14.32 35.18,14.32 34.46,13.6 27.3,13.6 v2(25.7,12)
$2N10: length 2
  Top Layer w0.25: R5.2 11.9,12.5 U2.5
$2N11: length 8
  Top Layer w0.15: D2.C 13.6,1.4 13.6,6 R6.2
$2N12: length 2
  Top Layer w0.25: R6.1 13.05,8.85 U2.1
$2N30: length 13.2
  Top Layer w0.15: D1.A 2.4,22.3 4.8,19.9 7.9,19.9 8.5,19.3 8.5,18.7 8.9,18.3 8.9,17.5 8.6,17.2 R11.2
$2N46: length 2.8
  Top Layer w0.15: D3.A 60.57,2.87 60.3,2.6 60.3,1.8 60.1,1.6 R13.2
$2N57: length 6.2
  Top Layer w0.15: D4.A 58.93,22.53 56.8,20.4 R3.2
$2N79: length 2.7
  Top Layer w0.15: 24.6,9.1 25.73,10.23 26.8,10.23
$2N1001: length 1.9
  Top Layer w0.15: R11.1 9.6,15.3 9.78,15.48 JP1.1
$2N5060: length 4.8
  Top Layer w0.15: S1.2 6.4,20.5 6.6,20.3 8,20.3 R4.1
$2N5296: length 2.8
  Top Layer w0.25: 14.13,19.33 14.13,17.53 R25.2
$2N5302: length 3.7
  Top Layer w0.25: 17.13,19.33 17.13,18.03 15.9,16.8 R26.2
$3N1: length 5.9
  Top Layer w0.15: C7.2 41.7,18 43.75,18 Y2.P$1 45.45,18.15 46.4,17.2 U1.17
$3N2: length 6
  Top Layer w0.15: U1.18 45.6,16.4 44.85,15.65 Y2.P$2 43.55,15.3 41.8,15.3 C8.2
$3N8: length 5.7
  Top Layer w0.15: R22.2 46.1,7.1 46.84,7.1 48.85,9.11
$3N9: length 6
  Top Layer w0.15: 48.05,9.16 46.49,7.6 46.04,7.6 45.2,8.44 45.2,9 44.6,9.6 R21.2
  Top Layer w0.25: 48.05,9.16 U1.34

## Copper pours and planes (outline as drawn; the poured copper is in the pictures)
GND on Top Layer: 58.1,25.1 58.1,16.3 56.9,16.3 56.9,14.7 58.1,14.7 58.1,0.4 58,0.3 2,0.3 1.3,0.5 0.8,0.8 0.6,1.1 0.49,1.39 0.3,2 0.3,23.5 0.49,24.01 0.9,24.5 1.39,24.91 2,25.1
GND on Bottom Layer: 58.1,25.1 58.1,0.3 2,0.3 1.3,0.5 0.8,0.8 0.6,1.1 0.49,1.39 0.3,2 0.3,23.5 0.49,24.01 0.9,24.5 1.39,24.91 2,25.1
GND on Mid-Top: 58.1,25.1 58.1,16.3 56.9,16.3 56.9,14.7 58.1,14.7 58.1,0.4 58,0.3 2,0.3 1.3,0.5 0.8,0.8 0.6,1.1 0.49,1.39 0.3,2 0.3,23.5 0.49,24.01 0.9,24.5 1.39,24.91 2,25.1
GND on Mid-Bottom: 58.1,25.1 58.1,0.3 2,0.3 1.3,0.5 0.8,0.8 0.6,1.1 0.49,1.39 0.3,2 0.3,23.5 0.49,24.01 0.9,24.5 1.39,24.91 2,25.1
VBUS on Top Layer: 16.63,21.84 18.05,21.84 18.05,20.45 16.63,20.45
VBUS on Mid-Bottom: 16.64,21.84 18.05,21.84 18.05,20.45 16.64,20.45

## Text on the board
Top Silkscreen Layer: + | -
